# EasyEDA Pro project EasyEDA Pro project.epro

# Schematic Schematic1
Board Name: Board1; Create Date: 2025-01-11; Page Name: P1; Project Name: Hackclub-NFC-Card; Schematic Name: Schematic1; Update Date: 2025-01-11; Company: EasyEDA.com; Page Size: A4; Version: V1.0
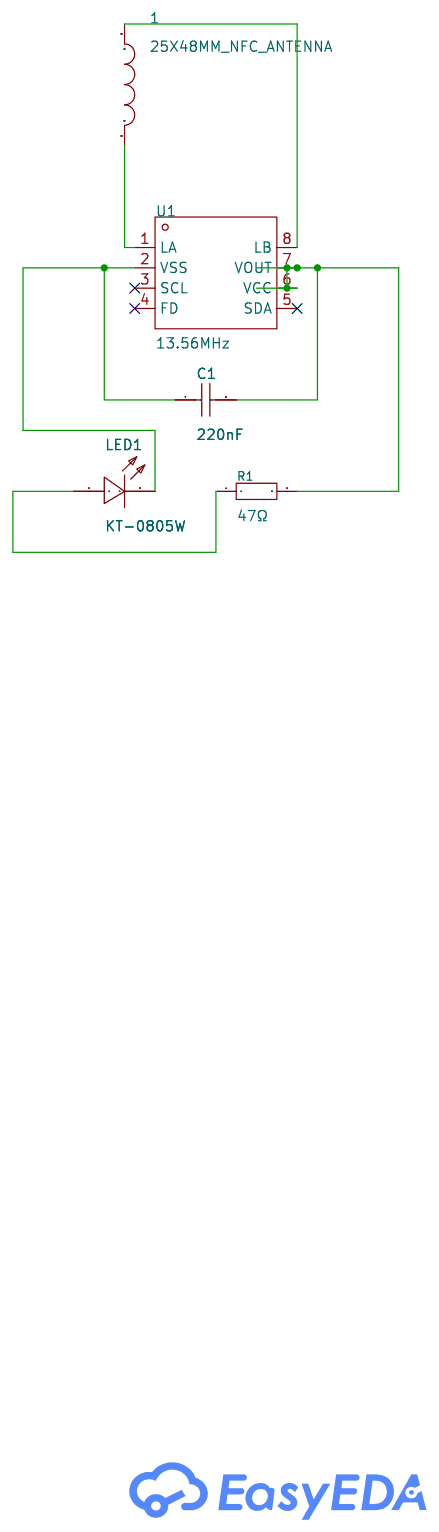
[diagram p0: schematic sheet]

## Parts
1  25X48MM_NFC_ANTENNA  [25X48MM_NFC_ANTENNA]
C1  220nF  [C0603]
LED1  KT-0805W  [LED0805-R-RD]
R1  47Ω  [R0603]
U1  13.56MHz  [XQFN-8_L1.6-W1.6-P0.50-BL_NT3H2111W0FHKH]

## Library data of the parts
1 = 25X48MM_NFC_ANTENNA
C1 = CL10B224KA8NNNC: Capacitance: Tolerance:±10% Tolerance:±10% Voltage Rated: Temperature Coefficient:; LCSC Part Name: 220nF ±10% 25V; Supplier Part: C21120; Manufacturer: SAMSUNG(三星); Supplier Footprint: 0603; JLCPCB Part Class: Basic Part; Datasheet: https://atta.szlcsc.com/upload/public/pdf/source/20160218/1457707763339.pdf; Supplier: LCSC; Tolerance: ±10%
LED1 = KT-0805W: LCSC Part Name: 0805 白灯 高亮; Supplier Part: C34499; Manufacturer: KENTO; Supplier Footprint: 0805; JLCPCB Part Class: Basic Part; Datasheet: https://atta.szlcsc.com/upload/public/pdf/source/20221124/DAA20402FFC1FB071B8B6797757426FE.pdf; Supplier: LCSC
R1 = 0603WAF470JT5E: Type:Thick Film Resistors Resistance:47Ω Tolerance:±1% Tolerance:±1% Power(Watts): Overload Voltage (Max): Temperature Coefficient:±100ppm/℃ Temperature Coefficient:±100ppm/℃ Operating Temperature Range:-55℃~+155℃ Operating Temperature Range:-55℃~+155℃; LCSC Part Name: 47Ω ±1% 100mW 厚膜电阻; Supplier Part: C23182; Manufacturer: UNI-ROYAL(厚声); Supplier Footprint: 0603; JLCPCB Part Class: Basic Part; Datasheet: https://atta.szlcsc.com/upload/public/pdf/source/20200306/C422600_1E6D84923E4A46A82E41ADD87F860B5C.pdf; Supplier: LCSC; Type: Thick Film Resistors; Tolerance: ±1%; Temperature Coefficient: ±100ppm/℃; Operating Temperature Range: -55℃~+155℃
U1 = NT3H2111W0FHKH: agreement:ISO 14443 interface type:I2C Frequency:13.56MHz Frequency:13.56MHz mains input:3.3V mains input:3.3V; Supplier Part: C710403; Manufacturer: NXP(恩智浦); Supplier Footprint: XQFN-8(1.6x1.6); JLCPCB Part Class: Extended Part; Datasheet: https://www.nxp.com/docs/en/data-sheet/NT3H2111_2211.pdf; Supplier: LCSC; agreement: ISO 14443; interface type: I2C; mains input: 3.3V

## Nets
$1N1255: LED1.1(A) R1.1
Net-(1-P$1): 1.P$1 U1.8(LB)
Net-(1-P$2): 1.P$2 U1.1(LA)
Net-(C1-1): C1.1 LED1.2(K) U1.2(VSS)
Net-(C1-2): C1.2 R1.2 U1.6(VCC) U1.7(VOUT)

Not connected (* = marked no-connect by the designer): U1 3(SCL)* 4(FD)* 5(SDA)*

# Board PCB1
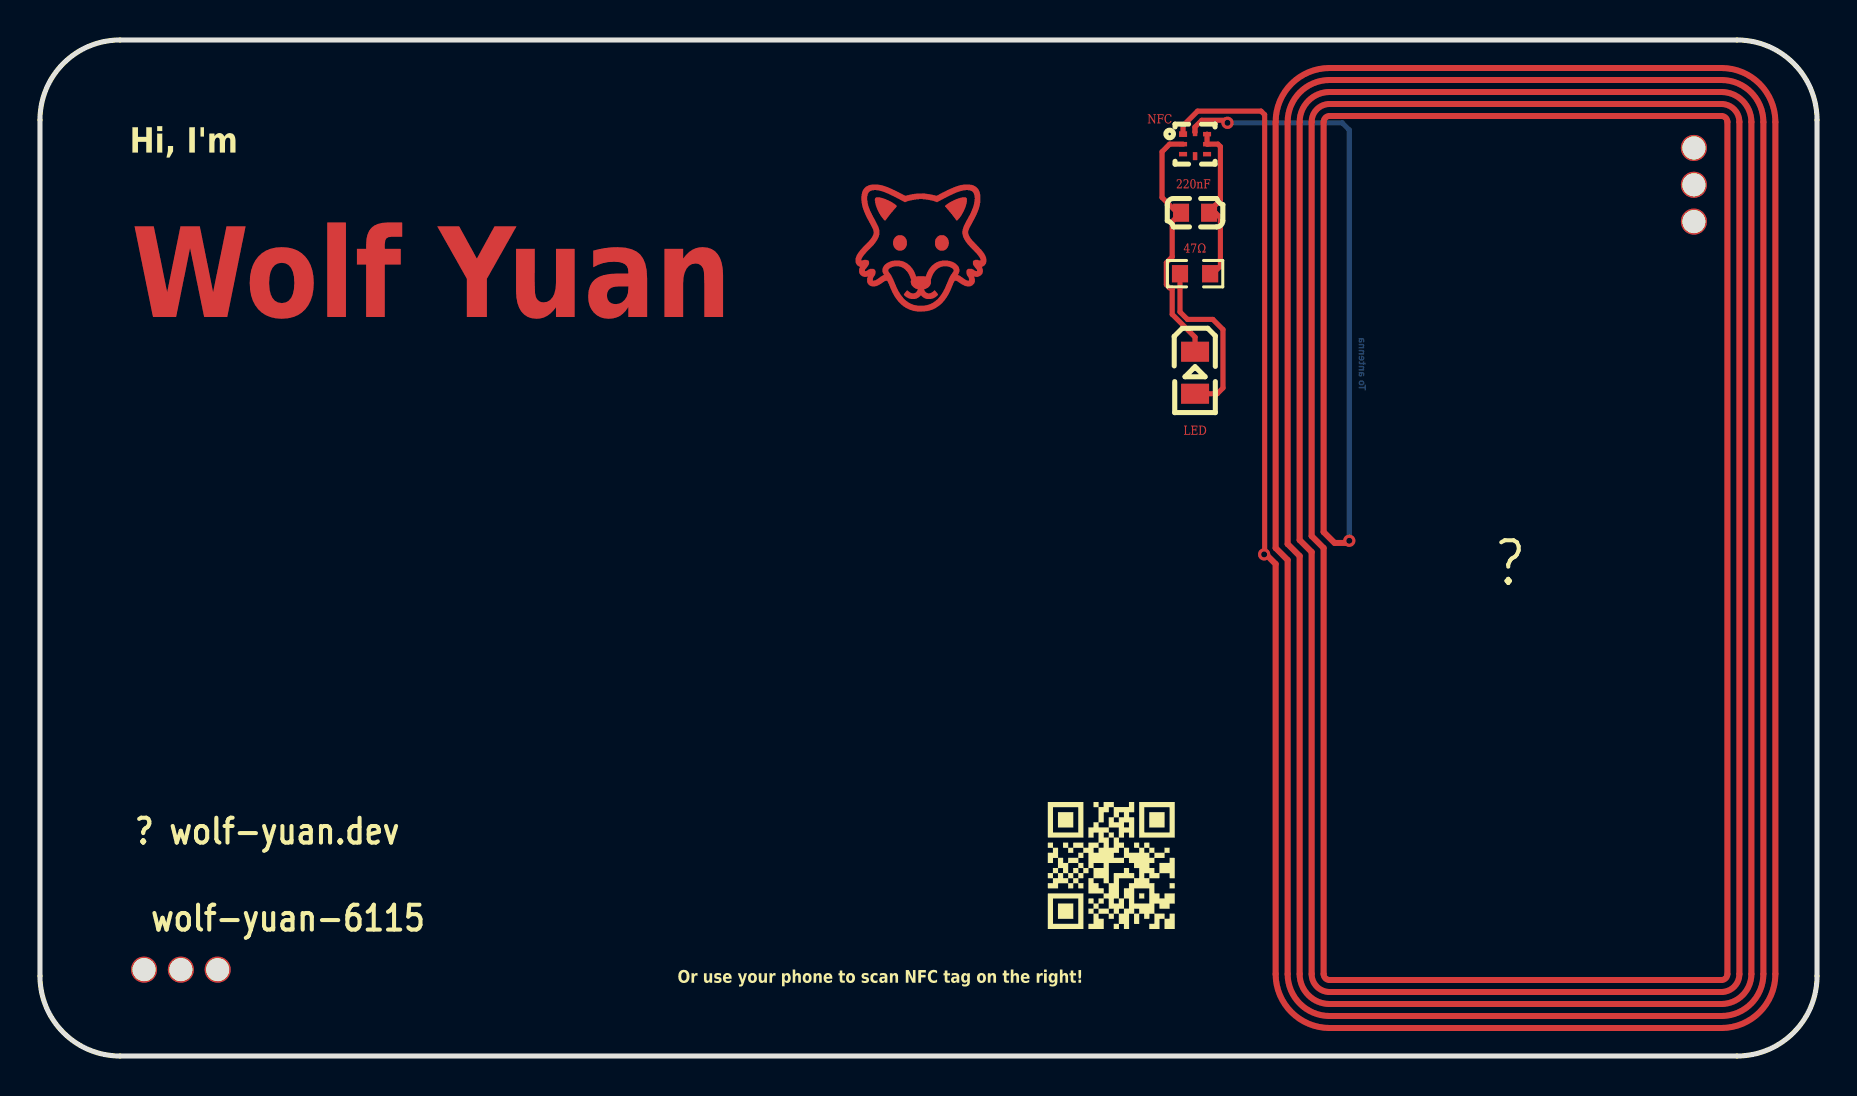
[diagram p1: board, top side]
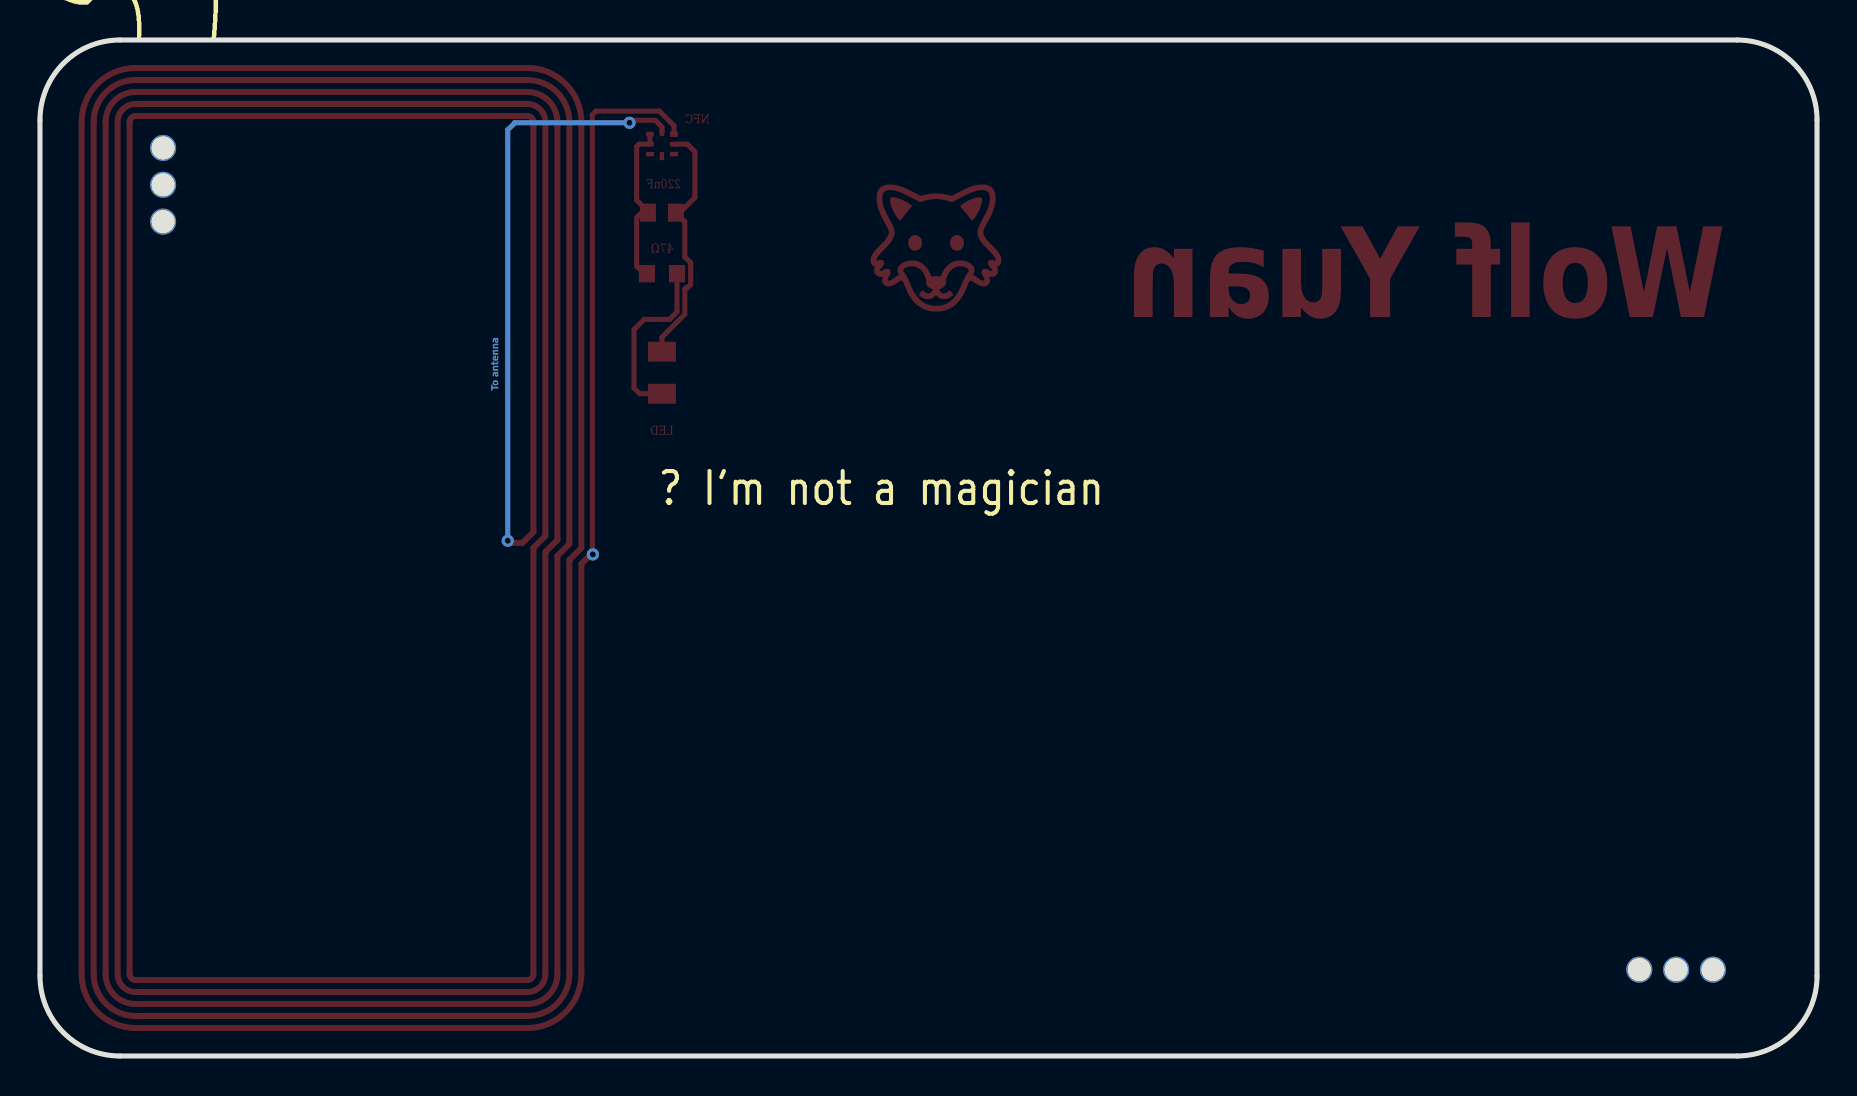
[diagram p2: board, bottom side, seen from below]

Outline 88.9 x 50.8 mm; copper layers: Top Layer, Bottom Layer. Coordinates in mm from the lower left corner of the outline.
Outline path: 0,46.8 0,4 arc(1.17,1.17) 4,0 84.9,0 arc(87.73,1.17) 88.9,4 88.9,46.8 arc(87.73,49.63) 84.9,50.8 4,50.8 arc(1.17,49.63) 0,46.8
Stack: Top Layer 0.035mm / Dielectric1 1.51mm FR4 er 4.5 / Bottom Layer 0.035mm

## Design rules (mm)
template: JLCPCB Capability(Two Layers Board)
spacing copperThickness1oz (default): track to track 0.102, other pairs 0.152 to 0.3
spacing copperThickness2oz: track to track 0.203, other pairs 0.152 to 0.3
track width copperThickness1oz (default): min 0.127, default 0.254, max 2.54
track width copperThickness2oz: min 0.203, default 0.254, max 2.54
differential pair differentialPair (default): width min 0.127, default 0.254, max 2.54; gap min 0.152, default 0.152
via viaSize (default): diameter min 0.5, default 0.61, max 10; hole min 0.3, default 0.305, max 6.3

## Placement (name value [footprint] x y rotation side)
C1  220nF  [C0603]  57.79 42.16 0 top
LED1  KT-0805W  [LED0805-R-RD]  57.79 34.16 270 top
NFC  13.56MHz  [XQFN-8_L1.6-W1.6-P0.50-BL_NT3H2111W0FHKH]  57.79 45.59 0 top
NOREF  -  [Pad_e537]  82.74 43.56 90 top
NOREF#2  -  [Pad_e521]  5.21 4.32 0 top
NOREF#3  -  [Pad_e538]  82.74 45.4 90 top
NOREF#4  -  [Pad_e525]  7.05 4.32 0 top
NOREF#5  -  [Pad_e526]  8.89 4.32 0 top
NOREF#6  -  [Pad_e536]  82.74 41.72 90 top
R1  47Ω  [R0603]  57.79 39.12 0 top

## Footprints (pads in the part's own frame, mm; a bottom-side part is the same pattern mirrored in y, then rotated)
C0603
  rect 0.8x0.9 smd: 1(-0.7,0) 2(0.7,0)
LED0805-R-RD
  rect 1x1.399 smd: 1(1.05,0) 2(-1.05,0)
Pad_e521
  round 1.306 hole 1.153: 1(0,0)
Pad_e525
  round 1.306 hole 1.153: 1(0,0)
Pad_e526
  round 1.306 hole 1.153: 1(0,0)
Pad_e536
  round 1.306 hole 1.153: 1(0,0)
Pad_e537
  round 1.306 hole 1.153: 1(0,0)
Pad_e538
  round 1.306 hole 1.153: 1(0,0)
R0603
  rect 0.806x0.864 smd: 1(-0.753,0) 2(0.753,0)
XQFN-8_L1.6-W1.6-P0.50-BL_NT3H2111W0FHKH
  rect 0.4x0.28 smd: 1(-0.6,0.5)
  rect 0.4x0.22 smd: 2(-0.6,0) 3(-0.6,-0.5) 5(0.6,-0.5) 6(0.6,0) 7(0.6,0.5)
  rect 0.22x0.4 smd: 4(0,-0.6) 8(0,0.6)

## Nets
$1N863: C1.2 NFC.6 NFC.7 R1.2
$1N880: NFC.1
$1N1158: NFC.8
$1N1255: LED1.1 R1.1
$1N1261: C1.1 LED1.2 NFC.2

Pads without a net: NFC 3 4 5; NOREF 1; NOREF#2 1; NOREF#3 1; NOREF#4 1; NOREF#5 1; NOREF#6 1

## Via types
v1: diameter 0.61, hole 0.305, Top Layer to Bottom Layer, 3 vias

## Routing (per net, layer and track width the routed paths; a pad name or vN(x,y) marks a point on that pad's centre or on a via; arc(x,y) is an arc through that point)
$1N863: length 8.5
  Top Layer w0.254: R1.2 58.67,39.12 59.05,39.49 59.05,41.91 58.8,42.16 C1.2 58.48,42.23 59.05,42.8 59.05,45.47 58.93,45.59 NFC.6 NFC.7
$1N880: length 76.2
  Top Layer w0.254: NFC.1 57.19,46.52 57.91,47.24 61.09,47.24 61.27,47.06 61.27,25.11 v1(61.24,25.08)
  Top Layer w0.299: 61.82,24.6 61.27,25.15
  Top Layer w0.3: 61.82,24.6 61.82,4.1 arc(62.61,2.19) 64.52,1.4 84.12,1.4 arc(86.03,2.19) 86.82,4.1
$1N1158: length 650.3
  Top Layer w0.254: NFC.8 57.78,46.2 57.78,46.45 58.12,46.79 59.28,46.79 v1(59.41,46.66)
  Top Layer w0.299: 64.22,26.2 64.76,25.65 ; 64.77,25.65 65.39,25.65 v1(65.5,25.76)
  Top Layer w0.3: 64.22,26.2 64.22,46.7 arc(64.3,46.91) 64.52,47 84.12,47 arc(84.33,46.91) 84.42,46.7 84.42,4.1 arc(84.33,3.89) 84.12,3.8 64.52,3.8 arc(64.3,3.89) 64.22,4.1 64.22,25.4 63.62,26 63.62,46.7 arc(63.88,47.34) 64.52,47.6 84.12,47.6 arc(84.75,47.34) 85.02,46.7 85.02,4.1 arc(84.75,3.46) 84.12,3.2 64.52,3.2 arc(63.88,3.46) 63.62,4.1 63.62,25.2 63.02,25.8 63.02,46.7 arc(63.46,47.76) 64.52,48.2 84.12,48.2 arc(85.18,47.76) 85.62,46.7 85.62,4.1 arc(85.18,3.04) 84.12,2.6 64.52,2.6 arc(63.46,3.04) 63.02,4.1 63.02,25 62.42,25.6 62.42,46.7 arc(63.03,48.18) 64.52,48.8 84.12,48.8 arc(85.6,48.18) 86.22,46.7 86.22,4.1 arc(85.6,2.62) 84.12,2 64.52,2 arc(63.03,2.62) 62.42,4.1 62.42,24.8 61.82,25.4 61.82,46.7 arc(62.61,48.61) 64.52,49.4 84.12,49.4 arc(86.03,48.61) 86.82,46.7 86.82,4.1
  Bottom Layer w0.254: v1(59.41,46.66) 65.14,46.66 65.5,46.3 v1(65.5,25.76)
$1N1255: length 8.9
  Top Layer w0.254: R1.1 57.03,37.2 57.4,36.83 58.67,36.83 59.18,36.32 59.18,33.4 58.89,33.11 LED1.1
$1N1261: length 12.7
  Top Layer w0.254: LED1.2 57.79,35.94 56.64,37.08 56.64,38.35 56.59,38.41 56.51,38.41 56.35,38.57 56.35,39.66 56.64,39.96 56.64,41.72 C1.1 56.9,42.16 56.13,42.93 56.13,45.21 56.52,45.59 NFC.2

Small or netless copper shapes (teardrops, artwork), in the pictures only: 18 on Top Layer

## Text on the board
Bottom Layer: To antenna
Bottom Silkscreen Layer: 󱐋 I'm not a magician
Top Layer: Wolf Yuan | NFC | 220nF | LED | 47Ω
Top Solder Mask Layer: Wolf Yuan | A developer from Taiwan
Top Silkscreen Layer: 󰎘 | Or use your phone to scan NFC tag on the right! | Hi, I'm | 󰖟 wolf-yuan.dev |  wolf-yuan-6115
